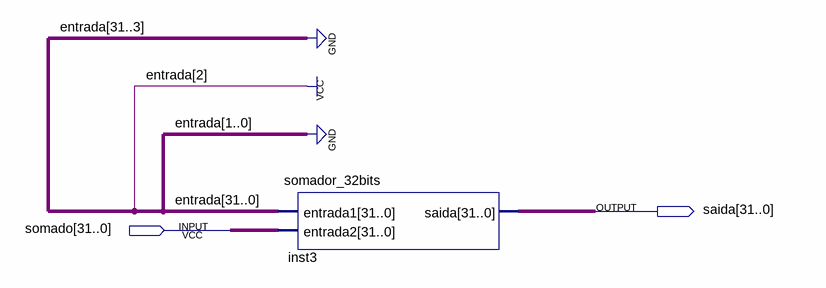
[diagram p0: schematic sheet]
// Quartus schematic teste.bdf as structural Verilog: 1 symbols, 2 pins
module teste (
  input  [31:0] somado,
  output [31:0] saida
);

  somador_32bits inst3 (.entrada1(32'b00000000000000000000000000000100), .entrada2(somado), .saida(saida));
endmodule
